# Altium schematic sheet Brake.SchDoc
size A4
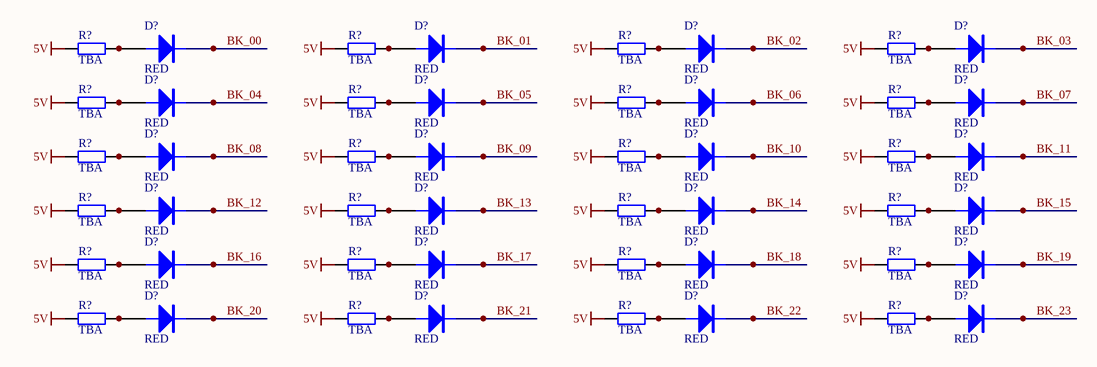
[diagram p0: Brake.SchDoc]

## Parts
(Parts that share a designator on the sheet are numbered #1, #2 ... from top to bottom, then left to right.)
D?#1  RED  [CREE P4 YELLOW]
D?#2  RED  [CREE P4 YELLOW]
D?#3  RED  [CREE P4 YELLOW]
D?#4  RED  [CREE P4 YELLOW]
D?#5  RED  [CREE P4 YELLOW]
D?#6  RED  [CREE P4 YELLOW]
D?#7  RED  [CREE P4 YELLOW]
D?#8  RED  [CREE P4 YELLOW]
D?#9  RED  [CREE P4 YELLOW]
D?#10  RED  [CREE P4 YELLOW]
D?#11  RED  [CREE P4 YELLOW]
D?#12  RED  [CREE P4 YELLOW]
D?#13  RED  [CREE P4 YELLOW]
D?#14  RED  [CREE P4 YELLOW]
D?#15  RED  [CREE P4 YELLOW]
D?#16  RED  [CREE P4 YELLOW]
D?#17  RED  [CREE P4 YELLOW]
D?#18  RED  [CREE P4 YELLOW]
D?#19  RED  [CREE P4 YELLOW]
D?#20  RED  [CREE P4 YELLOW]
D?#21  RED  [CREE P4 YELLOW]
D?#22  RED  [CREE P4 YELLOW]
D?#23  RED  [CREE P4 YELLOW]
D?#24  RED  [CREE P4 YELLOW]
R?#1  TBA  [RESISTOR 0.400"]
R?#2  TBA  [RESISTOR 0.400"]
R?#3  TBA  [RESISTOR 0.400"]
R?#4  TBA  [RESISTOR 0.400"]
R?#5  TBA  [RESISTOR 0.400"]
R?#6  TBA  [RESISTOR 0.400"]
R?#7  TBA  [RESISTOR 0.400"]
R?#8  TBA  [RESISTOR 0.400"]
R?#9  TBA  [RESISTOR 0.400"]
R?#10  TBA  [RESISTOR 0.400"]
R?#11  TBA  [RESISTOR 0.400"]
R?#12  TBA  [RESISTOR 0.400"]
R?#13  TBA  [RESISTOR 0.400"]
R?#14  TBA  [RESISTOR 0.400"]
R?#15  TBA  [RESISTOR 0.400"]
R?#16  TBA  [RESISTOR 0.400"]
R?#17  TBA  [RESISTOR 0.400"]
R?#18  TBA  [RESISTOR 0.400"]
R?#19  TBA  [RESISTOR 0.400"]
R?#20  TBA  [RESISTOR 0.400"]
R?#21  TBA  [RESISTOR 0.400"]
R?#22  TBA  [RESISTOR 0.400"]
R?#23  TBA  [RESISTOR 0.400"]
R?#24  TBA  [RESISTOR 0.400"]

## Nets
5V: R?#1.2 R?#2.2 R?#3.2 R?#4.2 R?#5.2 R?#6.2 R?#7.2 R?#8.2 R?#9.2 R?#10.2 R?#11.2 R?#12.2 R?#13.2 R?#14.2 R?#15.2 R?#16.2 R?#17.2 R?#18.2 R?#19.2 R?#20.2 R?#21.2 R?#22.2 R?#23.2 R?#24.2
BK_00: D?#1.1(K) D?#1.4(K)
BK_01: D?#2.1(K) D?#2.4(K)
BK_02: D?#3.1(K) D?#3.4(K)
BK_03: D?#4.1(K) D?#4.4(K)
BK_04: D?#5.1(K) D?#5.4(K)
BK_05: D?#6.1(K) D?#6.4(K)
BK_06: D?#7.1(K) D?#7.4(K)
BK_07: D?#8.1(K) D?#8.4(K)
BK_08: D?#9.1(K) D?#9.4(K)
BK_09: D?#10.1(K) D?#10.4(K)
BK_10: D?#11.1(K) D?#11.4(K)
BK_11: D?#12.1(K) D?#12.4(K)
BK_12: D?#13.1(K) D?#13.4(K)
BK_13: D?#14.1(K) D?#14.4(K)
BK_14: D?#15.1(K) D?#15.4(K)
BK_15: D?#16.1(K) D?#16.4(K)
BK_16: D?#17.1(K) D?#17.4(K)
BK_17: D?#18.1(K) D?#18.4(K)
BK_18: D?#19.1(K) D?#19.4(K)
BK_19: D?#20.1(K) D?#20.4(K)
BK_20: D?#21.1(K) D?#21.4(K)
BK_21: D?#22.1(K) D?#22.4(K)
BK_22: D?#23.1(K) D?#23.4(K)
BK_23: D?#24.1(K) D?#24.4(K)
NetD?#1_2: D?#1.2(A) D?#1.3(A) R?#1.1
NetD?#2_2: D?#2.2(A) D?#2.3(A) R?#2.1
NetD?#3_2: D?#3.2(A) D?#3.3(A) R?#3.1
NetD?#4_2: D?#4.2(A) D?#4.3(A) R?#4.1
NetD?#5_2: D?#5.2(A) D?#5.3(A) R?#5.1
NetD?#6_2: D?#6.2(A) D?#6.3(A) R?#6.1
NetD?#7_2: D?#7.2(A) D?#7.3(A) R?#7.1
NetD?#8_2: D?#8.2(A) D?#8.3(A) R?#8.1
NetD?#9_2: D?#9.2(A) D?#9.3(A) R?#9.1
NetD?#10_2: D?#10.2(A) D?#10.3(A) R?#10.1
NetD?#11_2: D?#11.2(A) D?#11.3(A) R?#11.1
NetD?#12_2: D?#12.2(A) D?#12.3(A) R?#12.1
NetD?#13_2: D?#13.2(A) D?#13.3(A) R?#13.1
NetD?#14_2: D?#14.2(A) D?#14.3(A) R?#14.1
NetD?#15_2: D?#15.2(A) D?#15.3(A) R?#15.1
NetD?#16_2: D?#16.2(A) D?#16.3(A) R?#16.1
NetD?#17_2: D?#17.2(A) D?#17.3(A) R?#17.1
NetD?#18_2: D?#18.2(A) D?#18.3(A) R?#18.1
NetD?#19_2: D?#19.2(A) D?#19.3(A) R?#19.1
NetD?#20_2: D?#20.2(A) D?#20.3(A) R?#20.1
NetD?#21_2: D?#21.2(A) D?#21.3(A) R?#21.1
NetD?#22_2: D?#22.2(A) D?#22.3(A) R?#22.1
NetD?#23_2: D?#23.2(A) D?#23.3(A) R?#23.1
NetD?#24_2: D?#24.2(A) D?#24.3(A) R?#24.1

## Library data of the parts
D?#1-D?#24 = CP41B-AFSCM0Q0264: CREE AMBER LED P4 (SUPERFLUX)
R?#1-R?#24 = CMP-iaxfckaaxq3jb0c9euu5-1: RESISITOR THROUGH HOLE 1/4W; CustomComponentID: iaxfckaaxq3jb0c9euu5